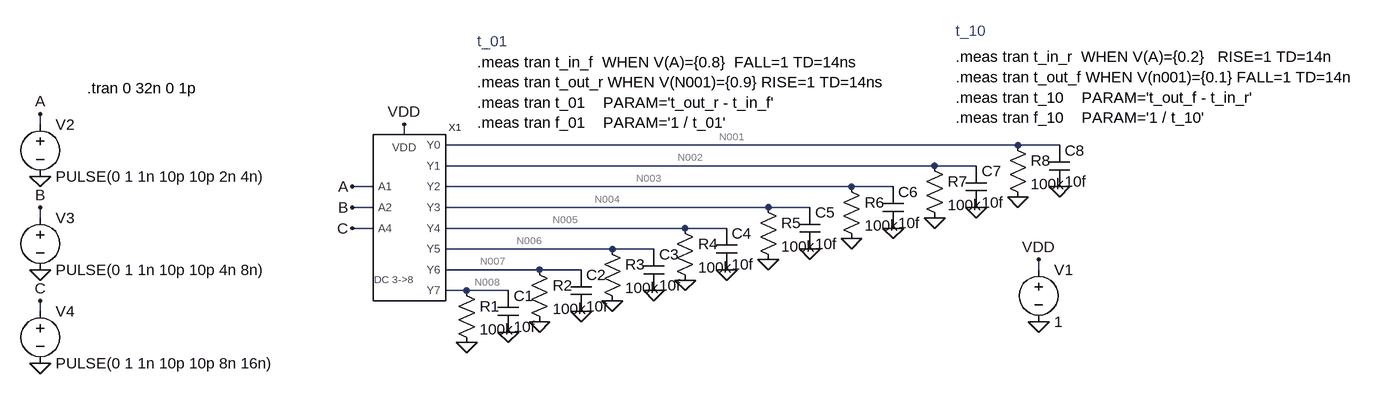
[diagram p0: schematic dc_3_8_test.asc]
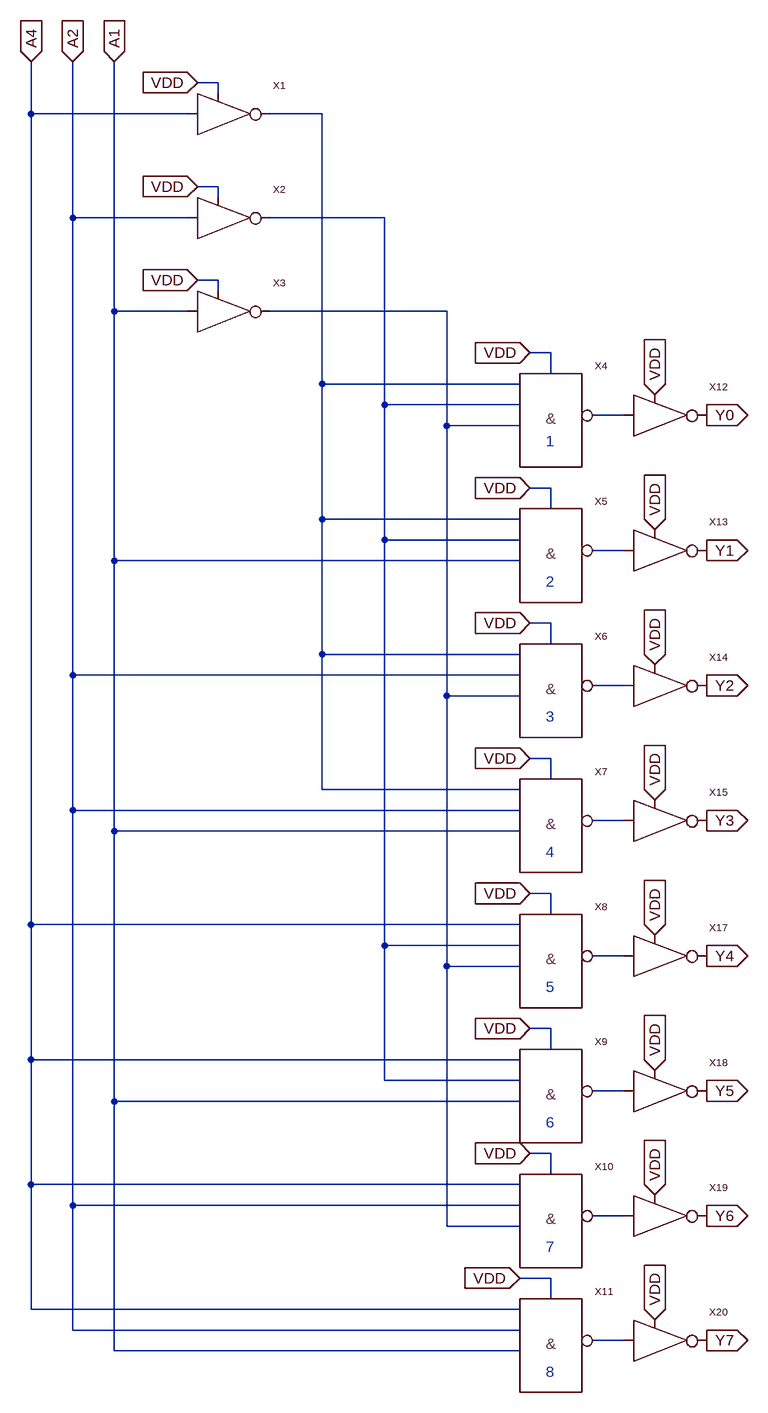
[diagram p1: sub-circuit dc_3_8.asc]
dc_3_8_test.asc, the LTspice schematic file:
Version 4.1
SHEET 1 2008 680
WIRE -416 -48 -416 -64
WIRE 144 -32 144 -48
WIRE 1088 -16 208 -16
WIRE 1152 -16 1088 -16
WIRE 960 16 208 16
WIRE 1024 16 960 16
WIRE 96 48 64 48
WIRE 832 48 208 48
WIRE 896 48 832 48
WIRE 96 80 64 80
WIRE 704 80 208 80
WIRE 768 80 704 80
WIRE -416 96 -416 80
WIRE 96 112 64 112
WIRE 576 112 208 112
WIRE 640 112 576 112
WIRE 464 144 208 144
WIRE 528 144 464 144
WIRE 352 176 208 176
WIRE 416 176 352 176
WIRE 1120 176 1120 160
WIRE 240 208 208 208
WIRE 304 208 240 208
WIRE -416 240 -416 224
FLAG 240 288 0
FLAG 304 272 0
FLAG 352 256 0
FLAG 416 240 0
FLAG 464 224 0
FLAG 528 208 0
FLAG 576 192 0
FLAG 640 176 0
FLAG 704 160 0
FLAG 768 144 0
FLAG 832 128 0
FLAG 896 112 0
FLAG 960 96 0
FLAG 1024 80 0
FLAG 1088 64 0
FLAG 1152 48 0
FLAG 64 48 A
FLAG 64 80 B
FLAG 64 112 C
FLAG 1120 256 0
FLAG 1120 160 VDD
FLAG -416 32 0
FLAG -416 -64 A
FLAG -416 176 0
FLAG -416 320 0
FLAG -416 80 B
FLAG -416 224 C
FLAG 144 -48 VDD
SYMBOL dc_3_8 144 96 R0
SYMATTR InstName X1
SYMBOL res 224 192 R0
SYMATTR InstName R1
SYMATTR Value 100k
SYMBOL cap 288 208 R0
SYMATTR InstName C1
SYMATTR Value 10f
SYMBOL res 336 160 R0
SYMATTR InstName R2
SYMATTR Value 100k
SYMBOL cap 400 176 R0
SYMATTR InstName C2
SYMATTR Value 10f
SYMBOL res 448 128 R0
SYMATTR InstName R3
SYMATTR Value 100k
SYMBOL cap 512 144 R0
SYMATTR InstName C3
SYMATTR Value 10f
SYMBOL res 560 96 R0
SYMATTR InstName R4
SYMATTR Value 100k
SYMBOL cap 624 112 R0
SYMATTR InstName C4
SYMATTR Value 10f
SYMBOL res 688 64 R0
SYMATTR InstName R5
SYMATTR Value 100k
SYMBOL cap 752 80 R0
SYMATTR InstName C5
SYMATTR Value 10f
SYMBOL res 816 32 R0
SYMATTR InstName R6
SYMATTR Value 100k
SYMBOL cap 880 48 R0
SYMATTR InstName C6
SYMATTR Value 10f
SYMBOL res 944 0 R0
SYMATTR InstName R7
SYMATTR Value 100k
SYMBOL cap 1008 16 R0
SYMATTR InstName C7
SYMATTR Value 10f
SYMBOL res 1072 -32 R0
SYMATTR InstName R8
SYMATTR Value 100k
SYMBOL cap 1136 -16 R0
SYMATTR InstName C8
SYMATTR Value 10f
SYMBOL voltage 1120 160 R0
WINDOW 123 0 0 Left 0
WINDOW 39 0 0 Left 0
SYMATTR InstName V1
SYMATTR Value 1
SYMBOL voltage -416 -64 R0
WINDOW 123 0 0 Left 0
WINDOW 39 0 0 Left 0
SYMATTR InstName V2
SYMATTR Value PULSE(0 1 1n 10p 10p 2n 4n)
SYMBOL voltage -416 80 R0
WINDOW 123 0 0 Left 0
WINDOW 39 0 0 Left 0
SYMATTR InstName V3
SYMATTR Value PULSE(0 1 1n 10p 10p 4n 8n)
SYMBOL voltage -416 224 R0
WINDOW 123 0 0 Left 0
WINDOW 39 0 0 Left 0
SYMATTR InstName V4
SYMATTR Value PULSE(0 1 1n 10p 10p 8n 16n)
TEXT -344 -104 Left 2 !.tran 0 32n 0 1p
TEXT 256 -176 Left 2 ;t_01
TEXT 992 -192 Left 2 ;t_10
TEXT 992 -152 Left 2 !.meas tran t_in_r  WHEN V(A)={0.2}   RISE=1 TD=14n\n.meas tran t_out_f WHEN V(n001)={0.1} FALL=1 TD=14n\n.meas tran t_10    PARAM='t_out_f - t_in_r'\n.meas tran f_10    PARAM='1 / t_10'
TEXT 256 -144 Left 2 !.meas tran t_in_f  WHEN V(A)={0.8}  FALL=1 TD=14ns\n.meas tran t_out_r WHEN V(N001)={0.9} RISE=1 TD=14ns\n.meas tran t_01    PARAM='t_out_r - t_in_f'\n.meas tran f_01    PARAM='1 / t_01'

dc_3_8.asc, the sub-circuit schematic file:
Version 4.1
SHEET 1 1032 1988
WIRE 128 -32 96 -32
WIRE 128 -16 128 -32
WIRE -160 16 -160 -64
WIRE 80 16 -160 16
WIRE 288 16 208 16
WIRE 128 128 96 128
WIRE 128 144 128 128
WIRE -96 176 -96 -64
WIRE 80 176 -96 176
WIRE 384 176 208 176
WIRE 128 272 96 272
WIRE 128 288 128 272
WIRE -32 320 -32 -64
WIRE 80 320 -32 320
WIRE 480 320 208 320
WIRE 640 384 608 384
WIRE 640 416 640 384
WIRE 288 432 288 16
WIRE 592 432 288 432
WIRE 384 464 384 176
WIRE 592 464 384 464
WIRE 752 480 704 480
WIRE 480 496 480 320
WIRE 592 496 480 496
WIRE 640 592 608 592
WIRE 640 624 640 592
WIRE 288 640 288 432
WIRE 592 640 288 640
WIRE 384 672 384 464
WIRE 592 672 384 672
WIRE 752 688 704 688
WIRE -32 704 -32 320
WIRE 592 704 -32 704
WIRE 640 800 608 800
WIRE 640 832 640 800
WIRE 288 848 288 640
WIRE 592 848 288 848
WIRE -96 880 -96 176
WIRE 592 880 -96 880
WIRE 752 896 704 896
WIRE 480 912 480 496
WIRE 592 912 480 912
WIRE 640 1008 608 1008
WIRE 640 1040 640 1008
WIRE 288 1056 288 848
WIRE 592 1056 288 1056
WIRE -96 1088 -96 880
WIRE 592 1088 -96 1088
WIRE 752 1104 704 1104
WIRE -32 1120 -32 704
WIRE 592 1120 -32 1120
WIRE 640 1216 608 1216
WIRE 640 1248 640 1216
WIRE -160 1264 -160 16
WIRE 592 1264 -160 1264
WIRE 384 1296 384 672
WIRE 592 1296 384 1296
WIRE 752 1312 704 1312
WIRE 480 1328 480 912
WIRE 592 1328 480 1328
WIRE 640 1424 608 1424
WIRE 640 1456 640 1424
WIRE -160 1472 -160 1264
WIRE 592 1472 -160 1472
WIRE 384 1504 384 1296
WIRE 592 1504 384 1504
WIRE 752 1520 704 1520
WIRE -32 1536 -32 1120
WIRE 592 1536 -32 1536
WIRE 640 1616 608 1616
WIRE 640 1648 640 1616
WIRE -160 1664 -160 1472
WIRE 592 1664 -160 1664
WIRE -96 1696 -96 1088
WIRE 592 1696 -96 1696
WIRE 752 1712 704 1712
WIRE 480 1728 480 1328
WIRE 592 1728 480 1728
WIRE 640 1808 592 1808
WIRE 640 1840 640 1808
WIRE -160 1856 -160 1664
WIRE 592 1856 -160 1856
WIRE -96 1888 -96 1696
WIRE 592 1888 -96 1888
WIRE 752 1904 704 1904
WIRE -32 1920 -32 1536
WIRE 592 1920 -32 1920
FLAG -32 -64 A1
IOPIN -32 -64 In
FLAG -96 -64 A2
IOPIN -96 -64 In
FLAG -160 -64 A4
IOPIN -160 -64 In
FLAG 592 1808 VDD
IOPIN 592 1808 In
FLAG 96 -32 VDD
IOPIN 96 -32 In
FLAG 96 128 VDD
IOPIN 96 128 In
FLAG 96 272 VDD
IOPIN 96 272 In
FLAG 880 480 Y0
IOPIN 880 480 Out
FLAG 880 688 Y1
IOPIN 880 688 Out
FLAG 880 896 Y2
IOPIN 880 896 Out
FLAG 880 1104 Y3
IOPIN 880 1104 Out
FLAG 880 1312 Y4
IOPIN 880 1312 Out
FLAG 880 1520 Y5
IOPIN 880 1520 Out
FLAG 880 1712 Y6
IOPIN 880 1712 Out
FLAG 880 1904 Y7
IOPIN 880 1904 Out
FLAG 608 592 VDD
IOPIN 608 592 In
FLAG 608 384 VDD
IOPIN 608 384 In
FLAG 608 800 VDD
IOPIN 608 800 In
FLAG 608 1008 VDD
IOPIN 608 1008 In
FLAG 608 1216 VDD
IOPIN 608 1216 In
FLAG 608 1424 VDD
IOPIN 608 1424 In
FLAG 608 1616 VDD
IOPIN 608 1616 In
FLAG 800 448 VDD
IOPIN 800 448 In
FLAG 800 656 VDD
IOPIN 800 656 In
FLAG 800 864 VDD
IOPIN 800 864 In
FLAG 800 1072 VDD
IOPIN 800 1072 In
FLAG 800 1280 VDD
IOPIN 800 1280 In
FLAG 800 1488 VDD
IOPIN 800 1488 In
FLAG 800 1680 VDD
IOPIN 800 1680 In
FLAG 800 1872 VDD
IOPIN 800 1872 In
SYMBOL inverter_nand2 144 16 R0
SYMATTR InstName X1
SYMBOL inverter_nand2 144 176 R0
SYMATTR InstName X2
SYMBOL inverter_nand2 144 320 R0
SYMATTR InstName X3
SYMBOL nand3 640 480 R0
SYMATTR InstName X4
SYMBOL nand3 640 688 R0
SYMATTR InstName X5
SYMBOL nand3 640 896 R0
SYMATTR InstName X6
SYMBOL nand3 640 1104 R0
SYMATTR InstName X7
SYMBOL nand3 640 1312 R0
SYMATTR InstName X8
SYMBOL nand3 640 1520 R0
SYMATTR InstName X9
SYMBOL nand3 640 1712 R0
SYMATTR InstName X10
SYMBOL nand3 640 1904 R0
SYMATTR InstName X11
SYMBOL inverter_nand2 816 480 R0
SYMATTR InstName X12
SYMBOL inverter_nand2 816 688 R0
SYMATTR InstName X13
SYMBOL inverter_nand2 816 896 R0
SYMATTR InstName X14
SYMBOL inverter_nand2 816 1104 R0
SYMATTR InstName X15
SYMBOL inverter_nand2 816 1312 R0
SYMATTR InstName X17
SYMBOL inverter_nand2 816 1520 R0
SYMATTR InstName X18
SYMBOL inverter_nand2 816 1712 R0
SYMATTR InstName X19
SYMBOL inverter_nand2 816 1904 R0
SYMATTR InstName X20
TEXT 632 520 Left 2 ;1
TEXT 632 736 Left 2 ;2
TEXT 632 944 Left 2 ;3
TEXT 632 1152 Left 2 ;4
TEXT 632 1360 Left 2 ;5
TEXT 632 1568 Left 2 ;6
TEXT 632 1760 Left 2 ;7
TEXT 632 1952 Left 2 ;8

The netlist it stands for:
* dc_3_8_test.asc
X§X1 A B C VDD N001 N002 N003 N004 N005 N006 N007 N008 dc_3_8
R1 N008 0 100k
C1 N008 0 10f
R2 N007 0 100k
C2 N007 0 10f
R3 N006 0 100k
C3 N006 0 10f
R4 N005 0 100k
C4 N005 0 10f
R5 N004 0 100k
C5 N004 0 10f
R6 N003 0 100k
C6 N003 0 10f
R7 N002 0 100k
C7 N002 0 10f
R8 N001 0 100k
C8 N001 0 10f
V1 VDD 0 1
V2 A 0 PULSE(0 1 1n 10p 10p 2n 4n)
V3 B 0 PULSE(0 1 1n 10p 10p 4n 8n)
V4 C 0 PULSE(0 1 1n 10p 10p 8n 16n)

* block symbol definitions
.subckt dc_3_8 A1 A2 A4 VDD Y0 Y1 Y2 Y3 Y4 Y5 Y6 Y7
X§X1 A4 N001 VDD inverter_nand2  ; pins VIN VOUT VDD
X§X2 A2 N002 VDD inverter_nand2  ; pins VIN VOUT VDD
X§X3 A1 N003 VDD inverter_nand2  ; pins VIN VOUT VDD
X§X4 N001 N002 N003 VDD N004 nand3  ; pins A B C VDD Y
X§X5 N001 N002 A1 VDD N005 nand3  ; pins A B C VDD Y
X§X6 N001 A2 N003 VDD N006 nand3  ; pins A B C VDD Y
X§X7 N001 A2 A1 VDD N007 nand3  ; pins A B C VDD Y
X§X8 A4 N002 N003 VDD N008 nand3  ; pins A B C VDD Y
X§X9 A4 N002 A1 VDD N009 nand3  ; pins A B C VDD Y
X§X10 A4 A2 N003 VDD N010 nand3  ; pins A B C VDD Y
X§X11 A4 A2 A1 VDD N011 nand3  ; pins A B C VDD Y
X§X12 N004 Y0 VDD inverter_nand2  ; pins VIN VOUT VDD
X§X13 N005 Y1 VDD inverter_nand2  ; pins VIN VOUT VDD
X§X14 N006 Y2 VDD inverter_nand2  ; pins VIN VOUT VDD
X§X15 N007 Y3 VDD inverter_nand2  ; pins VIN VOUT VDD
X§X17 N008 Y4 VDD inverter_nand2  ; pins VIN VOUT VDD
X§X18 N009 Y5 VDD inverter_nand2  ; pins VIN VOUT VDD
X§X19 N010 Y6 VDD inverter_nand2  ; pins VIN VOUT VDD
X§X20 N011 Y7 VDD inverter_nand2  ; pins VIN VOUT VDD
* 1
* 2
* 3
* 4
* 5
* 6
* 7
* 8
.ends dc_3_8

.tran 0 32n 0 1p
* t_01
* t_10
.meas tran t_in_r  WHEN V(A)={0.2}   RISE=1 TD=14n
.meas tran t_out_f WHEN V(n001)={0.1} FALL=1 TD=14n
.meas tran t_10    PARAM='t_out_f - t_in_r'
.meas tran f_10    PARAM='1 / t_10'
.meas tran t_in_f  WHEN V(A)={0.8}  FALL=1 TD=14ns
.meas tran t_out_r WHEN V(N001)={0.9} RISE=1 TD=14ns
.meas tran t_01    PARAM='t_out_r - t_in_f'
.meas tran f_01    PARAM='1 / t_01'
.backanno
.end

* Results of the author's LTspice run, read from the files saved beside the schematic
* Operating Point, zero values left out:
*   V(vdd) = 1 V
*   V(n001) = 986.8 mV
*   V(n003) = 219.3 µV
*   V(n006) = 219.2 µV
*   V(n008) = 219.2 µV
*   V(n002) = 219.3 µV
*   V(n004) = 219.2 µV
*   V(n005) = 219.3 µV
*   V(n007) = 219.3 µV
*   I(R4) = 2.193 nA
*   I(R5) = 2.192 nA
*   I(R8) = 9.868 µA
*   I(V1) = -11.15 µA
*   I(V2) = 175.7 pA
*   I(V4) = 657.4 pA
*   I(R2) = 2.193 nA
*   I(R3) = 2.192 nA
*   I(R6) = 2.193 nA
*   I(R7) = 2.193 nA
*   I(R1) = 2.192 nA
*   I(V3) = 205.8 pA
*   Ix(x1:a1) = -175.7 pA
*   Ix(x1:a2) = -205.8 pA
*   Ix(x1:a4) = -657.4 pA
*   Ix(x1:vdd) = 11.15 µA
*   Ix(x1:y0) = -9.868 µA
*   Ix(x1:y1) = -2.193 nA
*   Ix(x1:y2) = -2.193 nA
*   Ix(x1:y3) = -2.192 nA
*   Ix(x1:y4) = -2.193 nA
*   Ix(x1:y5) = -2.192 nA
*   Ix(x1:y6) = -2.193 nA
*   Ix(x1:y7) = -2.192 nA
* From the log:
*   t_in_r: V(A)={0.2} AT 1.70020000001e-08
*   t_out_f: V(n001)={0.1} AT 1.71920031594e-08
*   t_10: 't_out_f - t_in_r'=1.90003159357e-10
*   f_10: '1 / t_10'=5263070379.38
*   t_in_f: V(A)={0.8} AT 1.50120000002e-08
*   t_out_r: V(N001)={0.9} AT 1.51056091187e-08
*   t_01: 't_out_r - t_in_f'=9.36091184478e-11
*   f_01: '1 / t_01'=10682719980.5